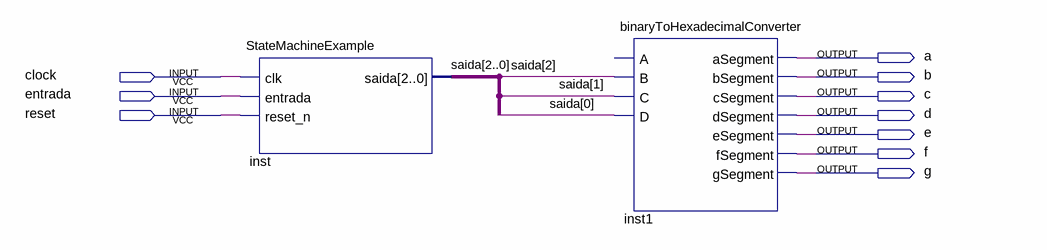
[diagram p0: schematic sheet]
// Quartus schematic sequenceDetector.bdf as structural Verilog: 2 symbols, 10 pins
module sequenceDetector (
  input  clock,
  input  entrada,
  input  reset,
  output a,
  output b,
  output c,
  output d,
  output e,
  output f,
  output g
);

  wire [2:0] saida;

  StateMachineExample inst (.clk(clock), .entrada(entrada), .reset_n(reset), .saida(saida));
  binaryToHexadecimalConverter inst1 (
    .B(saida[2]), .C(saida[1]), .D(saida[0]), .aSegment(a), .bSegment(b), .cSegment(c), .dSegment(d),
    .eSegment(e), .fSegment(f), .gSegment(g));  // open: A
endmodule
